# EasyEDA Pro project BLDCV6-nerdyintern.eprj, schematic Schematic3
Create Date: 2024-09-26; Page Name: P1; Project Name: BLDCV6; Schematic Name: Schematic3; Update Date: 2024-09-26; Company: EasyEDA.com; Drawn: EasyEDA; Page Size: A4; Part Number: JLCPCB-002; Reviewed: EasyEDA; Version: V0.1
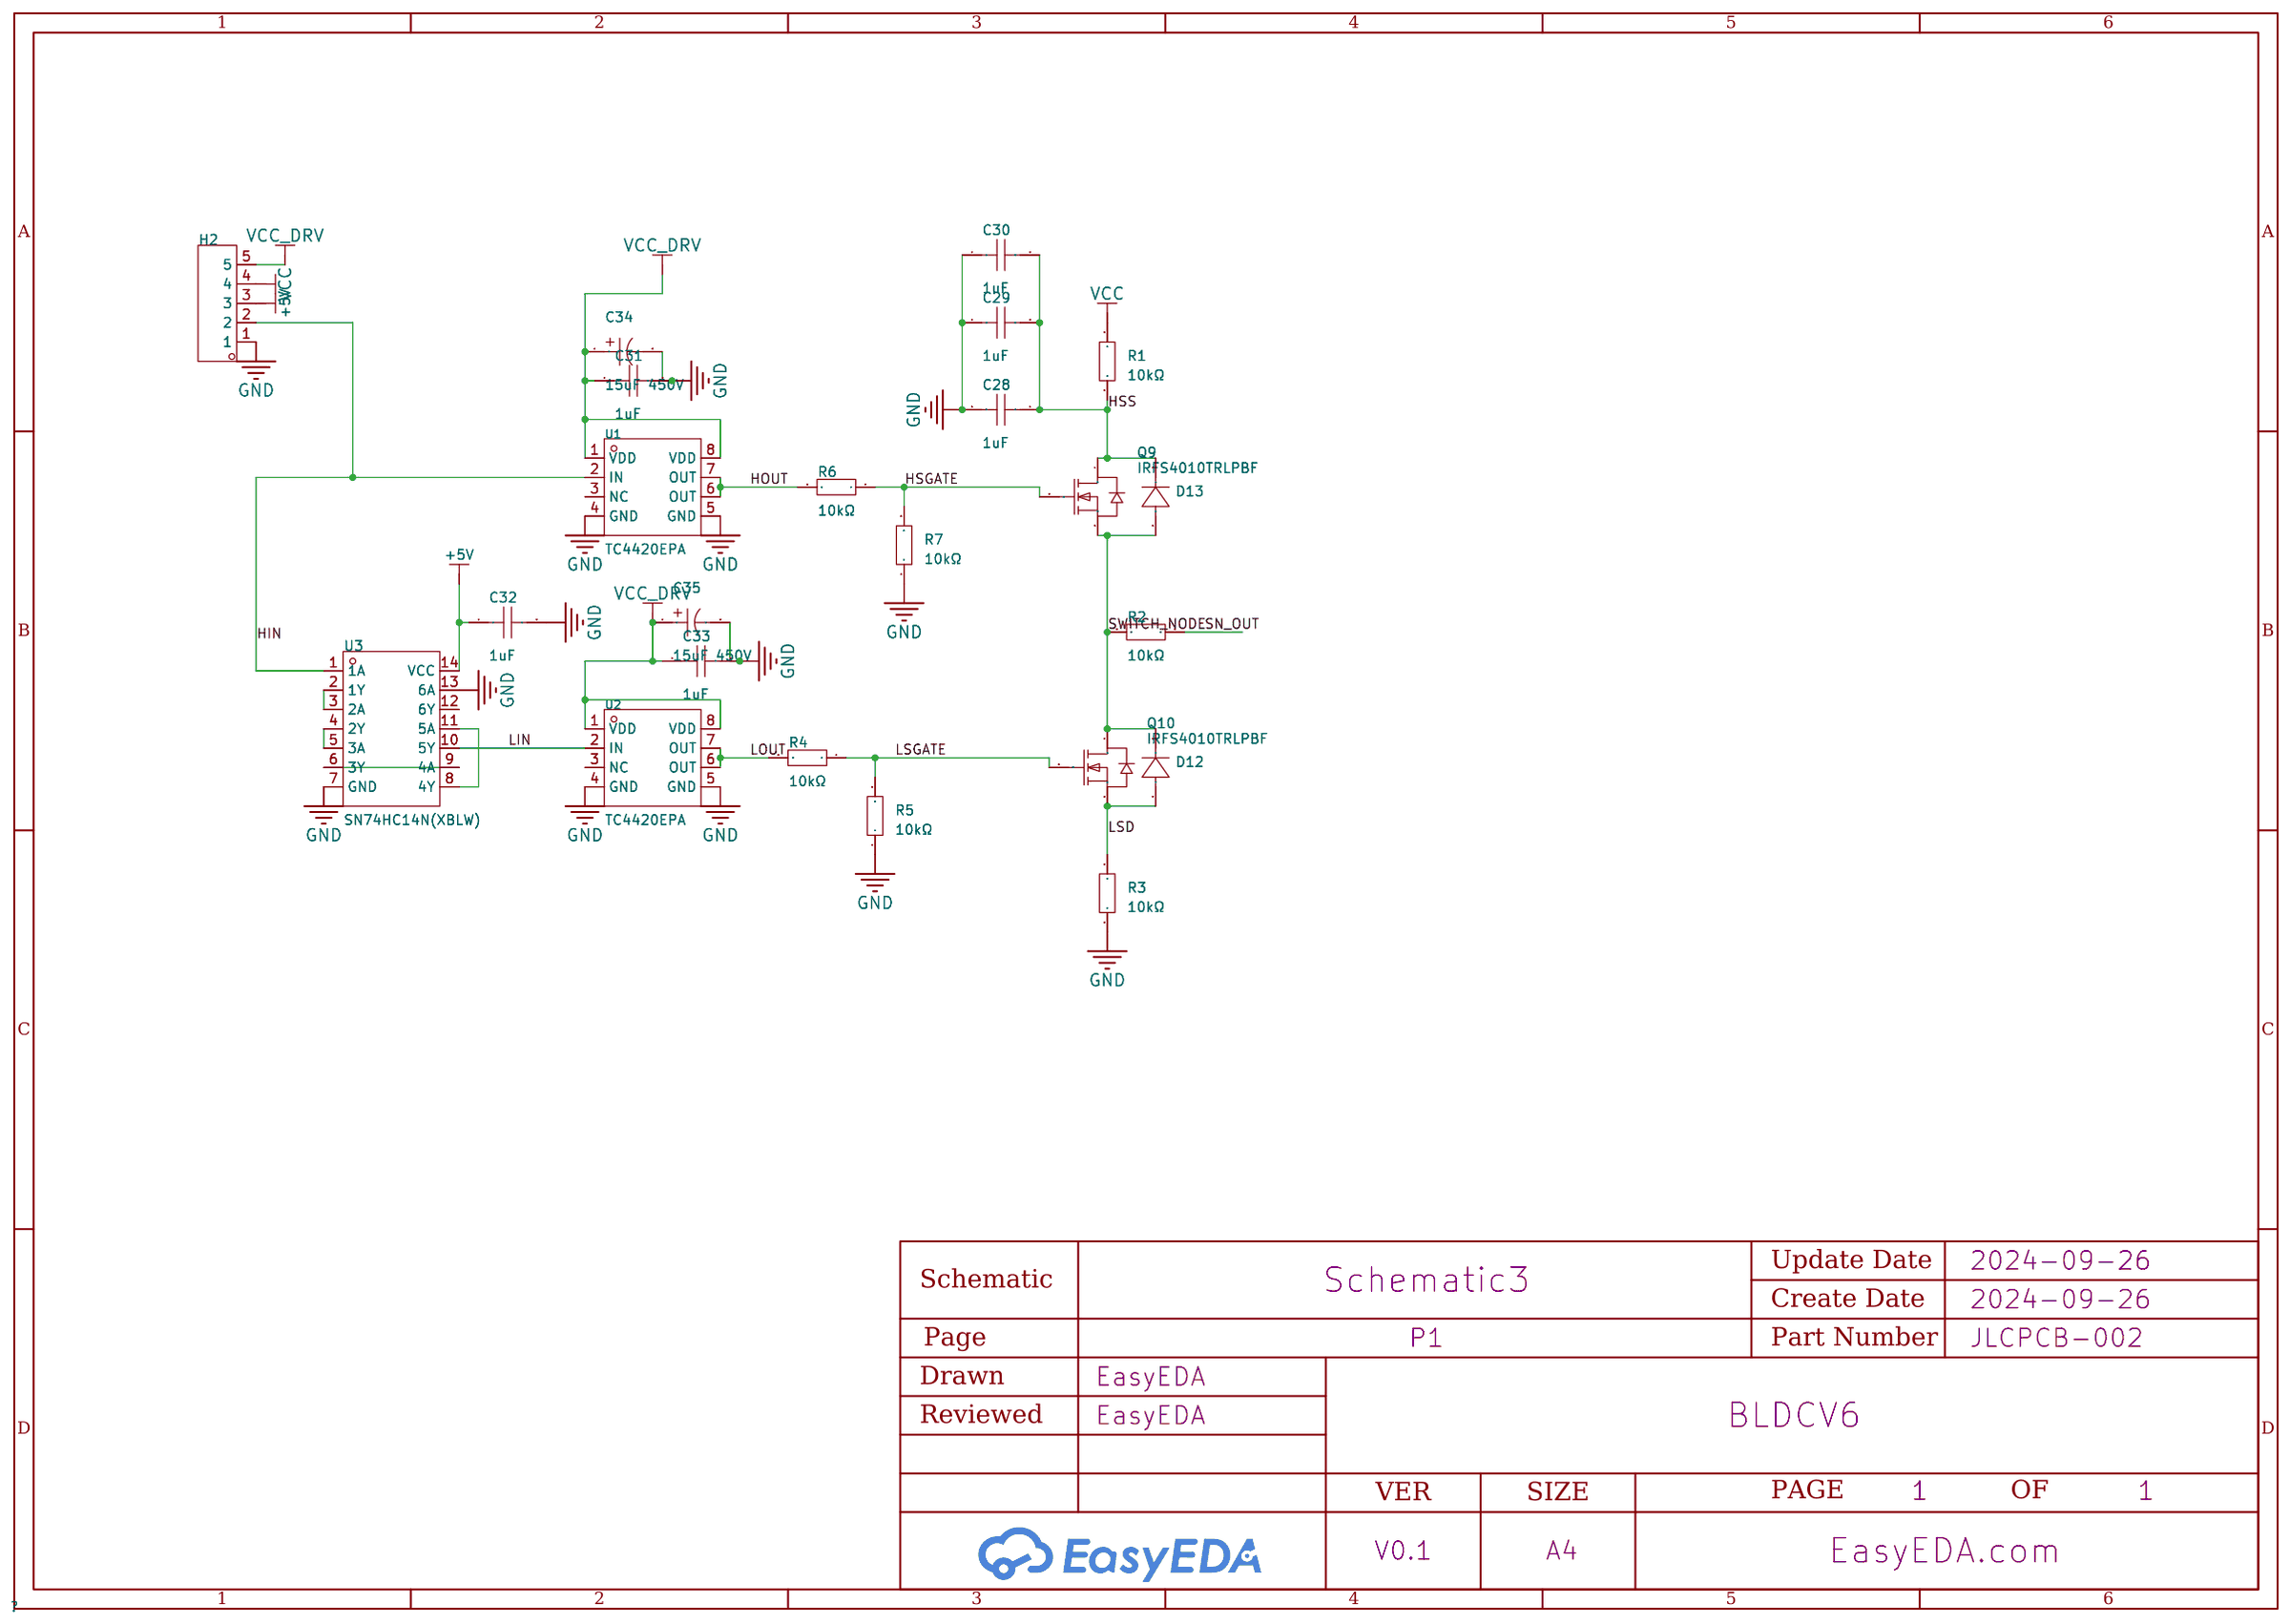
[diagram p2: schematic sheet]

## Parts
C28  1uF  [CAP-TH_L7.2-W2.5-P5.00-D0.6]
C29  1uF  [CAP-TH_L17.0-W8.5-P15.00-D0.8]
C30  1uF  [CAP-TH_L17.0-W8.5-P15.00-D0.8]
C31  1uF  [CAP-TH_L17.0-W8.5-P15.00-D0.8]
C32  1uF  [CAP-TH_L17.0-W8.5-P15.00-D0.8]
C33  1uF  [CAP-TH_L17.0-W8.5-P15.00-D0.8]
C34  15uF 450V  [CAP-TH_BD8.3-P3.00-D0.6-FD]
C35  15uF 450V  [CAP-TH_BD8.3-P3.00-D0.6-FD]
D12  -  [DO-41_BD2.4-L4.7-P8.70-D0.9-RD]
D13  -  [DO-41_BD2.4-L4.7-P8.70-D0.9-RD]
H2  -  [HDR-TH_5P-P2.54-V-M]
Q9  IRFS4010TRLPBF  [D2PAK_L9.1-W10.0-P2.54-LS15.3-BR-1]
Q10  IRFS4010TRLPBF  [D2PAK_L9.1-W10.0-P2.54-LS15.3-BR-1]
R1  10kΩ  [RES-TH_BD4.5-L11.5-P15.50-D0.8]
R2  10kΩ  [RES-TH_BD4.5-L11.5-P15.50-D0.8]
R3  10kΩ  [RES-TH_BD4.5-L11.5-P15.50-D0.8]
R4  10kΩ  [RES-TH_BD4.5-L11.5-P15.50-D0.8]
R5  10kΩ  [RES-TH_BD4.5-L11.5-P15.50-D0.8]
R6  10kΩ  [RES-TH_BD4.5-L11.5-P15.50-D0.8]
R7  10kΩ  [RES-TH_BD4.5-L11.5-P15.50-D0.8]
U1  TC4420EPA  [PDIP-8_L9.3-W6.4-P2.54-LS7.6-BL]
U2  TC4420EPA  [PDIP-8_L9.3-W6.4-P2.54-LS7.6-BL]
U3  SN74HC14N(XBLW)  [DIP-14_L19.0-W6.4-P2.54-LS7.6-BL]

## Library data of the parts
C28 = SMEC334J100M2: Capacitance: Tolerance:±5% Tolerance:±5% Voltage Rated:; LCSC Part Name: 330nF ±5% 100V; Supplier Part: C401104; Manufacturer: CHAMPION(全鹏); Supplier Footprint: 插件,P=5mm; JLCPCB Part Class: Extended Part; Datasheet: https://atta.szlcsc.com/upload/public/pdf/source/20190730/C401104_3330673C3D333BC9993FC47731C2A492.pdf; Supplier: LCSC; Tolerance: ±5%
C29-C33 = CFC2J105JG1I170KE100: Capacitance: Tolerance:±5% Tolerance:±5% Voltage Rated: Operating Temperature:-40℃~+105℃ Operating Temperature:-40℃~+105℃; LCSC Part Name: 1uF ±5% 630V; Supplier Part: C19712461; Manufacturer: Dersonic(德尔创); Supplier Footprint: 插件,P=15mm; JLCPCB Part Class: Extended Part; Datasheet: https://atta.szlcsc.com/upload/public/pdf/source/20231222/863053FE409B07859E357469CFF315BC.pdf; Supplier: LCSC; Tolerance: ±5%; Operating Temperature: -40℃~+105℃
C34 C35 = 15uF 450V: Supplier Part: C9900023023; Supplier Footprint: Capacitor;Electronic;15uF;450V; JLCPCB Part Class: Extended Part; Supplier: LCSC
D12 D13 = 1N4007: Supplier Footprint: DO-41
H2 = HDR-M_2.54_1x5P: Supplier Footprint: Through
Q9 Q10 = IRFS4010TRLPBF: Type:1个NChannel Drain Source Voltage (Vdss): Continuous Drain Current (Id): Power Dissipation (Pd): Drain Source On Resistance (RDS(on)@Vgs,Id):4.7mΩ@106A,10V Gate Threshold Voltage (Vgs(th)@Id):4V@250uA Total Gate Charge (Qg@Vgs):215nC@10V Input Capacita; LCSC Part Name: 1个N沟道 耐压:100V 电流:180A; Supplier Part: C538014; Manufacturer: Infineon(英飞凌); Supplier Footprint: D2PAK; JLCPCB Part Class: Extended Part; Datasheet: https://atta.szlcsc.com/upload/public/pdf/source/20200522/C538014_ECAE1AD36155800A57BA846B4DCA8F0D.pdf; Supplier: LCSC; Type: 1个NChannel; Drain Source On Resistance (RDS(on)@Vgs,Id): 4.7mΩ@106A,10V; Gate Threshold Voltage (Vgs(th)@Id): 4V@250uA; Total Gate Charge (Qg@Vgs): 215nC@10V; Input Capacitance (Ciss@Vds): 9.575nF@50V; Operating Temperature: -55℃~+175℃@(Tj)
R1-R7 = Res_AXIAL-1W: Supplier Footprint: Through
U1 U2 = TC4420EPA: Driven Configuration:低边 Load Type:MOSFET Number of Drivers:1 Peak Output Current(sink):6A Peak Output Current(source):6A Supply Voltage:4.5V~18V Supply Voltage:4.5V~18V Rise Time:25ns Fall Time:25ns Operating Temperature:-40℃~+150℃@(Tj) Operating Temperat; Supplier Part: C640742; Manufacturer: MICROCHIP(美国微芯); Supplier Footprint: PDIP-8; JLCPCB Part Class: Extended Part; Datasheet: https://atta.szlcsc.com/upload/public/pdf/source/20200713/C640742_D7817CF09533775675EB51132F523831.pdf; Supplier: LCSC; Driven Configuration: 低边; Load Type: MOSFET; Number of Drivers: 1; Peak Output Current(sink): 6A; Peak Output Current(source): 6A; Supply Voltage: 4.5V~18V; Rise Time: 25ns; Fall Time: 25ns; Operating Temperature: -40℃~+150℃@(Tj)
U3 = SN74HC14N(XBLW): Input Type:- Supply Voltage(Single):2V~6V Supply Voltage(Single):2V~6V Supply Current (Max):- Number of Circuits:- Number of Inputs:- Sink Current:- Source Current:- High level range (VIH):- High level range (VIH):- Low level range (VIL):- Low level range; LCSC Part Name: SN74HC14N; Supplier Part: C18723505; Manufacturer: XBLW(芯伯乐); Supplier Footprint: DIP-14; JLCPCB Part Class: Extended Part; Datasheet: https://atta.szlcsc.com/upload/public/pdf/source/20231019/A20BEDFA671A29CDF9CA4716764D88DB.pdf; Supplier: LCSC; Supply Voltage(Single): 2V~6V

## Nets
+5V: C32.1 H2.3 U3.14(VCC)
GND: C28.2 C29.1 C30.1 C31.2 C32.2 C33.2 C34.2 C35.2 H2.1 R3.2 R5.1 R7.1 U1.4(GND) U1.5(GND) U2.4(GND) U2.5(GND) U3.7(GND) U3.13(6A)
VCC: H2.4 R1.2
VCC_DRV: C31.1 C33.1 C34.1 C35.1 H2.5 U1.1(VDD) U1.8(VDD) U2.1(VDD) U2.8(VDD)
HIN: H2.2 U1.2(IN) U3.1(1A)
HOUT: R6.2 U1.6(OUT) U1.7(OUT)
HSGATE: Q9.1(G) R6.1 R7.2
HSS: C28.1 C29.2 C30.2 D13.1(K) Q9.4(D) R1.1
LIN: U2.2(IN) U3.10(5Y)
LOUT: R4.2 U2.6(OUT) U2.7(OUT)
LSD: D12.2(A) Q10.3(S) R3.1
LSGATE: Q10.1(G) R4.1 R5.2
SN_OUT: R2.1
SWITCH_NODE: D12.1(K) D13.2(A) Q9.3(S) Q10.4(D) R2.2
$1N1254: U3.2(1Y) U3.3(2A)
$1N1258: U3.4(2Y) U3.5(3A)
$1N1261: U3.6(3Y) U3.9(4A)
$1N1264: U3.8(4Y) U3.11(5A)

Not connected (* = marked no-connect by the designer): U1 3(NC); U2 3(NC); U3 12(6Y)
